# Altium schematic sheet userInterface.SchDoc
size A4
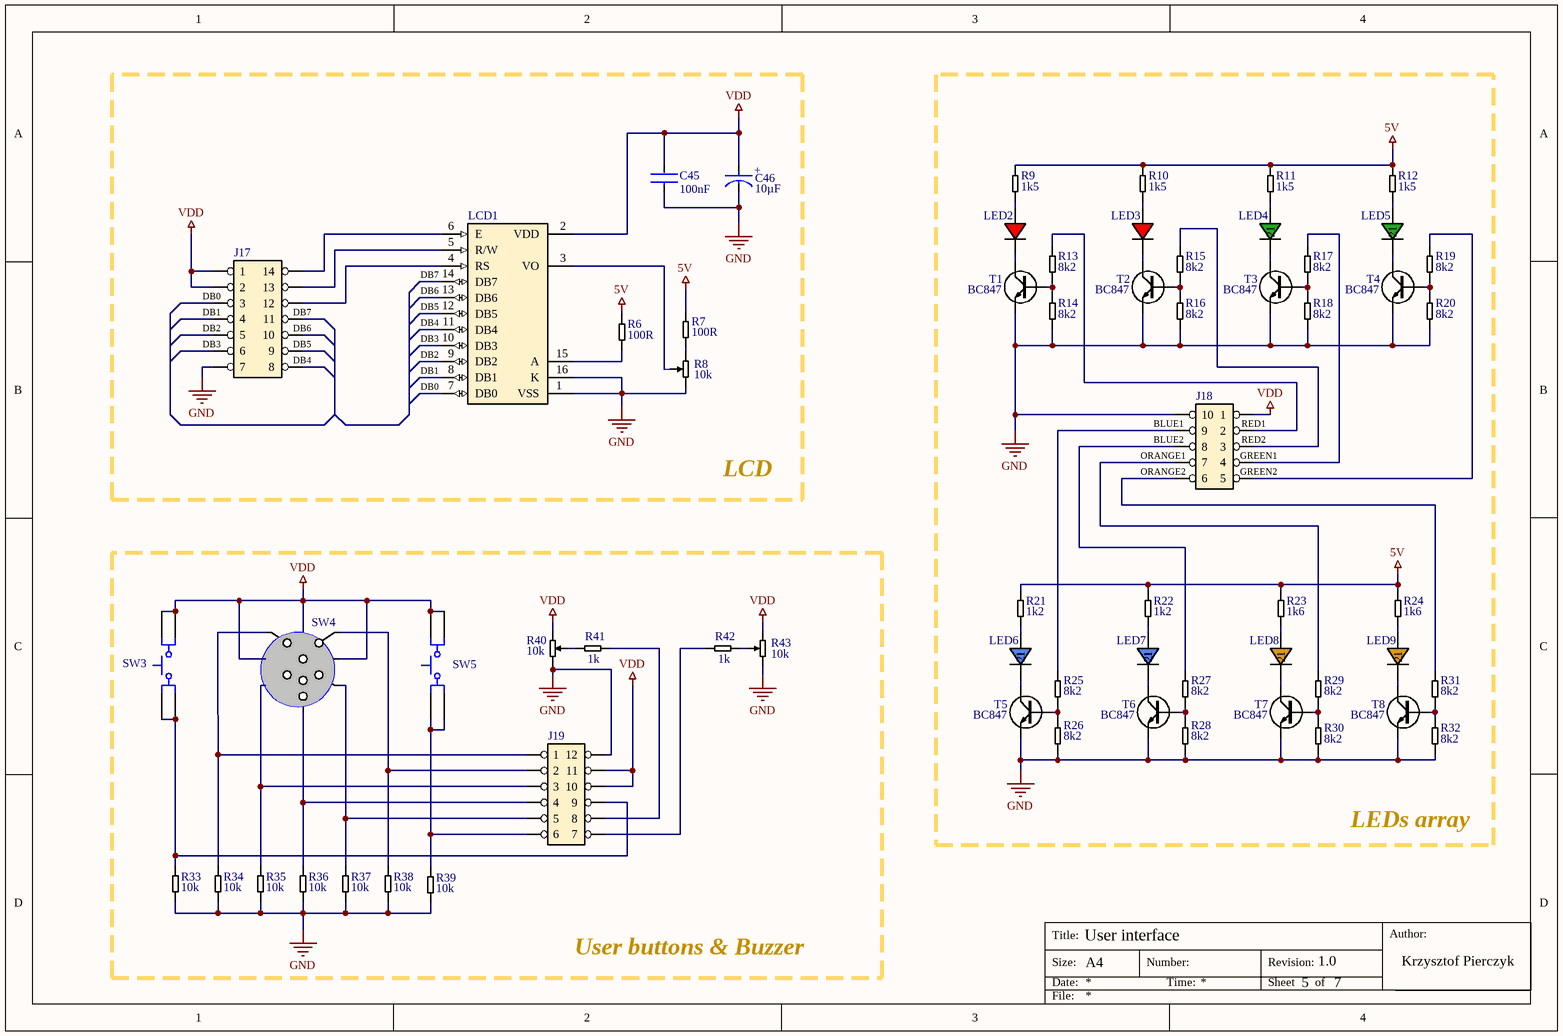
[diagram p0: userInterface.SchDoc]

## Parts
C45  value 100nF  [FP-C0805C-DN-MFG]  (hidden comment: C0805C102J5GACTU)
C46  Capacitance: 10µF  [FP-F98S-MFG]  (hidden comment: F981C106MSAAS1)
J17  Header 2x7  [Header 2x7]  (value not drawn)
J18  Header 2x5  [Header2x5]  (value not drawn)
J19  Header 2x6  [Header 2x6]  (value not drawn)
LCD1  LCD (16:2)  [LCD (16:2)]  (value not drawn)
LED2  Red LED  [LED (0805)]  (value not drawn)
LED3  Red LED  [LED (0805)]  (value not drawn)
LED4  Green LED  [LED (0805)]  (value not drawn)
LED5  Green LED  [LED (0805)]  (value not drawn)
LED6  Blue LED  [LED (0805)]  (value not drawn)
LED7  Blue LED  [LED (0805)]  (value not drawn)
LED8  Orange LED  [LED (0805)]  (value not drawn)
LED9  Orange LED  [LED (0805)]  (value not drawn)
R6  Resistance: 100R  [0805]  (hidden comment: Resistor)
R7  Resistance: 100R  [0805]  (hidden comment: Resistor)
R8  Resistance: 10k  [TM3FJ]  (hidden comment: Potentiometer)
R9  Resistance: 1k5  [0805]  (hidden comment: Resistor)
R10  Resistance: 1k5  [0805]  (hidden comment: Resistor)
R11  Resistance: 1k5  [0805]  (hidden comment: Resistor)
R12  Resistance: 1k5  [0805]  (hidden comment: Resistor)
R13  Resistance: 8k2  [0805]  (hidden comment: Resistor)
R14  Resistance: 8k2  [0805]  (hidden comment: Resistor)
R15  Resistance: 8k2  [0805]  (hidden comment: Resistor)
R16  Resistance: 8k2  [0805]  (hidden comment: Resistor)
R17  Resistance: 8k2  [0805]  (hidden comment: Resistor)
R18  Resistance: 8k2  [0805]  (hidden comment: Resistor)
R19  Resistance: 8k2  [0805]  (hidden comment: Resistor)
R20  Resistance: 8k2  [0805]  (hidden comment: Resistor)
R21  Resistance: 1k2  [0805]  (hidden comment: Resistor)
R22  Resistance: 1k2  [0805]  (hidden comment: Resistor)
R23  Resistance: 1k6  [0805]  (hidden comment: Resistor)
R24  Resistance: 1k6  [0805]  (hidden comment: Resistor)
R25  Resistance: 8k2  [0805]  (hidden comment: Resistor)
R26  Resistance: 8k2  [0805]  (hidden comment: Resistor)
R27  Resistance: 8k2  [0805]  (hidden comment: Resistor)
R28  Resistance: 8k2  [0805]  (hidden comment: Resistor)
R29  Resistance: 8k2  [0805]  (hidden comment: Resistor)
R30  Resistance: 8k2  [0805]  (hidden comment: Resistor)
R31  Resistance: 8k2  [0805]  (hidden comment: Resistor)
R32  Resistance: 8k2  [0805]  (hidden comment: Resistor)
R33  Resistance: 10k  [0805]  (hidden comment: Resistor)
R34  Resistance: 10k  [0805]  (hidden comment: Resistor)
R35  Resistance: 10k  [0805]  (hidden comment: Resistor)
R36  Resistance: 10k  [0805]  (hidden comment: Resistor)
R37  Resistance: 10k  [0805]  (hidden comment: Resistor)
R38  Resistance: 10k  [0805]  (hidden comment: Resistor)
R39  Resistance: 10k  [0805]  (hidden comment: Resistor)
R40  Resistance: 10k  [TM3FJ]  (hidden comment: Potentiometer)
R41  Resistance: 1k  [0805]  (hidden comment: Resistor)
R42  Resistance: 1k  [0805]  (hidden comment: Resistor)
R43  Resistance: 10k  [TM3FJ]  (hidden comment: Potentiometer)
SW3  4-1437565-1  [TECO-4-1437565-1_V]  (value not drawn)
SW4  KLS7-MT-01  [KLS-JOY-SW]  (value not drawn)
SW5  4-1437565-1  [TECO-4-1437565-1_V]  (value not drawn)
T1  BC847  [SOT-23-3]
T2  BC847  [SOT-23-3]
T3  BC847  [SOT-23-3]
T4  BC847  [SOT-23-3]
T5  BC847  [SOT-23-3]
T6  BC847  [SOT-23-3]
T7  BC847  [SOT-23-3]
T8  BC847  [SOT-23-3]

## Blocks framed on the sheet
LCD: C45 C46 J17 LCD1 R6-R8
LEDs array: J18 LED2-LED9 R9-R32 T1-T8
User buttons & Buzzer: J19 R33-R43 SW3-SW5

## Nets
5V: R6.2 R7.2 R9.2 R10.2 R11.2 R12.2 R21.2 R22.2 R23.2 R24.2
GND: C45.1 C46.1(C) J17.7 J18.10 J19.12 LCD1.1(VSS) LCD1.16(K) R8.2 R14.1 R16.1 R18.1 R20.1 R26.1 R28.1 R30.1 R32.1 R33.1 R34.1 R35.1 R36.1 R37.1 R38.1 R39.1 R40.2 R43.2 T1.2(E) T2.2(E) T3.2(E) T4.2(E) T5.2(E) T6.2(E) T7.2(E) T8.2(E)
VDD: C45.2 C46.2(A) J17.1 J17.2 J18.1 J19.10 J19.11 LCD1.2(VDD) R40.3 R43.3 SW3.3 SW3.4 SW4.5 SW4.7 SW4.8 SW5.3 SW5.4
BLUE1: J18.9 R25.1
BLUE2: J18.8 R27.2
DB0: J17.3 LCD1.7(DB0)
DB1: J17.4 LCD1.8(DB1)
DB2: J17.5 LCD1.9(DB2)
DB3: J17.6 LCD1.10(DB3)
DB4: J17.8 LCD1.11(DB4)
DB5: J17.9 LCD1.12(DB5)
DB6: J17.10 LCD1.13(DB6)
DB7: J17.11 LCD1.14(DB7)
GREEN1: J18.4 R17.2
GREEN2: J18.5 R19.2
ORANGE1: J18.7 R29.2
ORANGE2: J18.6 R31.2
RED1: J18.2 R13.2
RED2: J18.3 R15.2
NetJ17_12: J17.12 LCD1.4(RS)
NetJ17_13: J17.13 LCD1.5(R/W)
NetJ17_14: J17.14 LCD1.6(E)
NetJ19_1: J19.1 R34.2 SW4.4
NetJ19_2: J19.2 R38.2 SW4.6
NetJ19_3: J19.3 R35.2 SW4.1
NetJ19_4: J19.4 R36.2 SW4.2
NetJ19_5: J19.5 R37.2 SW4.3
NetJ19_6: J19.6 R39.2 SW5.1 SW5.2
NetJ19_7: J19.7 R42.1
NetJ19_8: J19.8 R41.2
NetJ19_9: J19.9 R33.2 SW3.1 SW3.2
NetLCD1_3: LCD1.3(VO) R8.1
NetLCD1_15: LCD1.15(A) R6.1
NetLED2_1: LED2.1 R9.1
NetLED2_2: LED2.2 T1.3(C)
NetLED3_1: LED3.1 R10.1
NetLED3_2: LED3.2 T2.3(C)
NetLED4_1: LED4.1 R11.1
NetLED4_2: LED4.2 T3.3(C)
NetLED5_1: LED5.1 R12.1
NetLED5_2: LED5.2 T4.3(C)
NetLED6_1: LED6.1 R21.1
NetLED6_2: LED6.2 T5.3(C)
NetLED7_1: LED7.1 R22.1
NetLED7_2: LED7.2 T6.3(C)
NetLED8_1: LED8.1 R23.1
NetLED8_2: LED8.2 T7.3(C)
NetLED9_1: LED9.1 R24.1
NetLED9_2: LED9.2 T8.3(C)
NetR7_1: R7.1 R8.3
NetR13_1: R13.1 R14.2 T1.1(B)
NetR15_1: R15.1 R16.2 T2.1(B)
NetR17_1: R17.1 R18.2 T3.1(B)
NetR19_1: R19.1 R20.2 T4.1(B)
NetR25_2: R25.2 R26.2 T5.1(B)
NetR27_1: R27.1 R28.2 T6.1(B)
NetR29_1: R29.1 R30.2 T7.1(B)
NetR31_1: R31.1 R32.2 T8.1(B)
NetR40_1: R40.1 R41.1
NetR42_2: R42.2 R43.1

## Notes on the sheet
- User interface
- 5
- 1.0
- 7
- Title:
- Size:
- Date:
- A4
- Number:
- Time:
- Revision:
- Sheet
- of
- Author:
- Krzysztof Pierczyk
- File:
- (in symbol CMP-04424-000018-1) +

## Library data of the parts
C45 = CMP-03020-008364-1: CAP CER 1000PF 50V C0G/NP0 0805; Manufacturer: KEMET; Capacitance: 1,000 pF; Temperature Characteristic: C0G; Material: Ceramic; Temperature Coefficient: 30ppm/°C; Tolerance: 0.05; Automotive: No; Voltage Rating: 50 V; Device Class L1: Passive Components; Digikey Description: CAP CER 1000PF 50V C0G/NP0 0805; Lead Free: Yes; Package: C0805C-DN; RoHS: TRUE; Temperature Range High: +125°C; Height: 0.88mm; Ipc Land Pattern Name: CAPC200125X78; Category: Cap; ComponentLink2URL: https://content.kemet.com/datasheets/KEM_C1003_C0G_SMD.pdf; Device Class L2: Capacitors; ComponentLink2Description: Datasheet; Temperature: -55°C to +125°C; Octopart: https://octopart.com/c0805c102j5gactu-kemet-97757; Mouser Description: Multilayer Ceramic Capacitors MLCC - SMD/SMT 50volts 1000pF C0G 5%; Manufacturer Part Number: C0805C102J5GACTU; Device Class L3: Ceramic Capacitors; Temperature Range Low: -55°C
C46 = CMP-04424-000018-1: CAP TANT 10UF 20% 16V 0805; Manufacturer: AVX; Esr: 4.5Ω; Material: Tantalum; Ripple Current: 100mA; Leakage Current: 1.6uA; Life: 1000Hours; Dissipation Factor: 18%; Temperature Range High: +125°C; Temperature: -55°C to +125°C; Digikey Description: CAP TANT 10UF 20% 16V 0805; Tolerance: 20%; Automotive: No; Voltage Rating: 16V; Device Class L3: Tantalum Capacitors; Package: F98S; Device Class L2: Capacitors; Footprint Url: https://www.avx.com/download/software/literature/AVX-Footprint-Library.pdf; Mouser Description: Cap Tant Solid 10uF 16V S CASE 20% (2 x 1.25 x 0.8mm) SMD 2012-09 4.5Ohm 125°C T/R; Value: 10uF; ComponentLink2URL: http://datasheets.avx.com/F98-AS1.pdf; Height: 0.9mm; Manufacturer Part Number: F981C106MSAAS1; ComponentLink2Description: Datasheet; Lead Free: Yes; Category: Cap; Temperature Coefficient: 20%; RoHS: TRUE; Temperature Range Low: -55°C; Octopart: https://octopart.com/f981c106msaas1-avx-49645945; Device Class L1: Passive Components
LCD1 = LCD (16:2): Display Lcd 35x75mm; MP: LM016L; MF: Hitachi; Availability: Unavailable; Package: None; Value: *; Price: None; SnapEDA_Link: https://www.snapeda.com/parts/LM016L/Hitachi/view-part/229734/?ref=snap
LED2 LED3 = Red LED: Nominal current: 2mA; Nominal voltage: 1.95V; ComponentLink1Description: Datasheet; ComponentLink1URL: http://www.farnell.com/datasheets/2863963.pdf?_ga=2.217691222.1193962280.1589558354-303286379.1586364067&_gac=1.191757912.1589563198.Cj0KCQjw-_j1BRDkARIsAJcfmTFIG7O-lBwUzM7jXL1d54rcmK8ZCJrBZphKUIU-ia_1DnqilNgsh1YaAq1qEALw_wcB
LED4 LED5 = Green LED: Nominal current: 2mA; Nominal voltage: 1.9V
LED6 LED7 = Blue LED: Nominal current: 20ma; Nominal voltage: 3.3V
LED8 LED9 = Orange LED: Nominal current: 2mA; Nominal voltage: 1.8V
R6 R7 R9-R39 R41 R42 = Resistor: Nominal power: 125mW
R8 R40 R43 = Potentiometer: Nominal power: 125mW; Type: linear
SW3 SW5 = CMP-2000-05602-1: Tactile Switch, 50 mA, 12 VDC, -20 to 85 degC, 4-Pin SMD, RoHS, Bulk; Manufacturer: TEConnectivity/AMPBrand; Illumination Type: N/R; Maximum Contact Resistance: 100mOhm; Actuator Style: RoundButton; Actuator Length: 1.4mm; Contact Rating @ Voltage: 0.05@12VDCA; Maximum DC Voltage Rating: 12V; Body Orientation: Straight; Ground Terminal: No; Dielectric Strength: 500VAC; Operating Force: 1.57N; Electrical Life: 100000Cycle; Mechanical Life: N/A; Family: FSMJSMA; Contact Material: CopperAlloy; Type: N/A; RoHS: Yes; Pole Throw Configuration: N/A; Operating Temperature: -20to85C; Minimum Insulation Resistance: 100MOhm; Package Description: 4-Pin Surface Mount Device, Body 6 x 6 mm, Pitch 9.1 mm; Housing Material: N/A; Switch Configuration: N/A; Mounting: SurfaceMount,GullWing; Datasheet URL: https://datasheet.ciiva.com/14635/0900766b80912216-14635826.pdf; Packaging: Bulk; Base Material: N/A; Actuator Color: N/A; Dimension: 6x10x5.25mm; Contact Plating: Silver; Seal Location: N/A; Mounting Technology: SurfaceMount; Part No: 4-1437565-1; Seal Description: N/A; Maximum AC Voltage Rating: N/A; Datasheet Version: 04/2007; Manufacturer URL: http://www.te.com/; Package Reference: 4-1437565-1; Product Weight: N/A
SW4 = Joystick: 4-directional microswitch with center push; Rating: 100mA / 12V DC; Contact Resistance: 500M max.; Withstand Voltage: 250V DC (50Hz); Mechanical Life: 100000 times; Operating Force: 4 direction 160+/-50gf; center push 280+/-100gf; Movement: 4 direction 0.20+/-0.1mm; center push 0.15+/-0.1gf; ComponentLink1Description: Datasheet; ComponentLink1URL: https://www.rcscomponents.kiev.ua/datasheets/daatasheet-prztmt-01.pdf; Ambient Temperature Tange: -10*C to +60*C
T1-T8 = BC847: ComponentLink1Description: Datasheet; ComponentLink1URL: https://assets.nexperia.com/documents/data-sheet/BC856_BC857_BC858.pdf